# Altium project PHANTOM_VCU.PrjPcb (part 1 of 4)
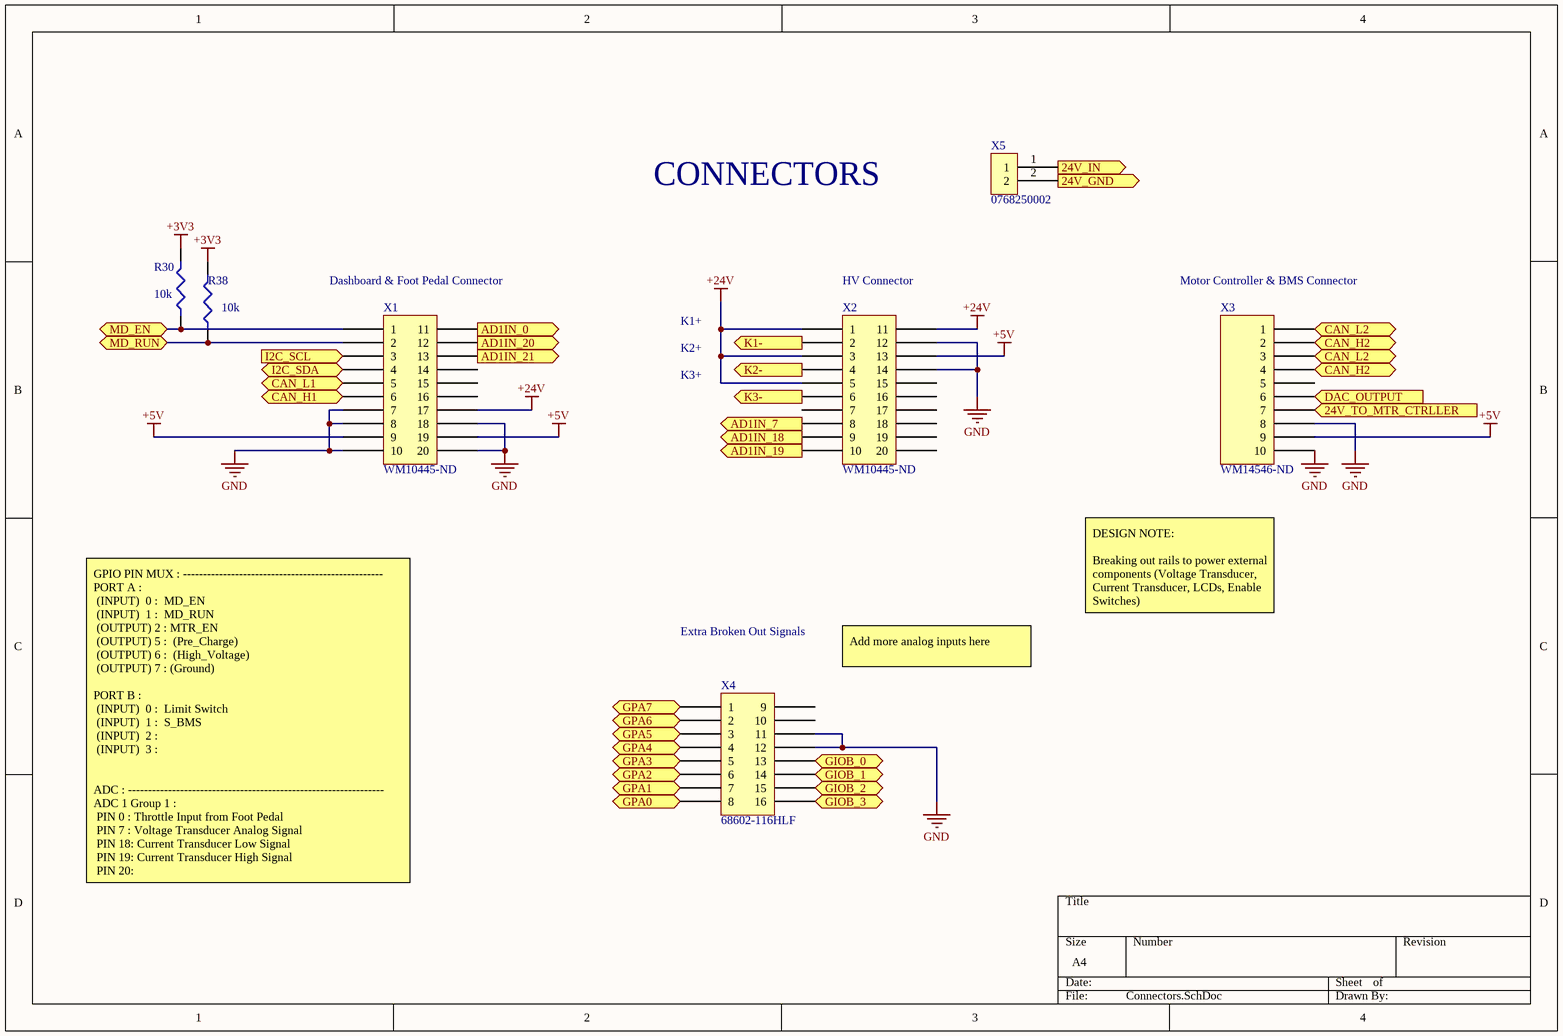
[diagram p0: Connectors.SchDoc]
8 sheets, 173 parts. Net scope: flat (ports and power ports of the same name join across sheets).
Board file: VCU_LAYOUT.PcbDoc
Sheets:
  Connectors.SchDoc
  Power_Sensing.SchDoc
  Power_MCU.SchDoc
  VCU_Schematic.SchDoc
  MCU_Signals.SchDoc
  CAN.SchDoc
  Contactor_Switching.SchDoc
  ADC_Decoupling.SchDoc

## Sheet Connectors.SchDoc
size A4; DocumentNumber: 1; SheetNumber: 1; SheetTotal: 8

### Parts
R30  10k  [R0805]
R38  10k  [R0805]
X1  WM10445-ND  [MOLEX_20pin]
X2  WM10445-ND  [MOLEX_20pin]
X3  WM14546-ND  [MOLEX_10PIN]
X4  68602-116HLF  [16PIN_HEADER]
X5  0768250002  [MOLEX_2PIN_MEGAFIT]

### Ports
24V_GND, 24V_IN, 24V_TO_MTR_CTRLLER, AD1IN_0, AD1IN_7, AD1IN_18, AD1IN_19, AD1IN_20, AD1IN_21, CAN_H1, CAN_H2, CAN_L1, CAN_L2, DAC_OUTPUT, GIOB_0, GIOB_1, GIOB_2, GIOB_3, GPA0, GPA1, GPA2, GPA3, GPA4, GPA5, GPA6, GPA7, I2C_SCL, I2C_SDA, K1-, K2-, K3-, MD_EN, MD_RUN

### Nets
+3V3: R30.2 R38.2
+5V: X1.9 X1.19 X2.13 X3.9
+24V: X1.17 X2.1 X2.3 X2.5 X2.11
GND: X1.7 X1.8 X1.10 X1.18 X1.20 X2.12 X2.14 X3.8 X3.10 X4.11 X4.12
24V_GND: X5.2 ; port 24V_GND
24V_IN: X5.1 ; port 24V_IN
24V_MC: X3.7 ; port 24V_TO_MTR_CTRLLER
AD1IN_0: X1.11 ; port AD1IN_0
AD1IN_7: X2.8 ; port AD1IN_7
AD1IN_18: X2.9 ; port AD1IN_18
AD1IN_19: X2.10 ; port AD1IN_19
AD1IN_20: X1.12 ; port AD1IN_20
AD1IN_21: X1.13 ; port AD1IN_21
CAN_H1: X1.6 ; port CAN_H1
CAN_H2: X3.2 X3.4 ; port CAN_H2
CAN_L1: X1.5 ; port CAN_L1
CAN_L2: X3.1 X3.3 ; port CAN_L2
DAC_OUTPUT: X3.6 ; port DAC_OUTPUT
GIOB_0: X4.13 ; port GIOB_0
GIOB_1: X4.14 ; port GIOB_1
GIOB_2: X4.15 ; port GIOB_2
GIOB_3: X4.16 ; port GIOB_3
GPA0: X4.8 ; port GPA0
GPA1: X4.7 ; port GPA1
GPA2: X4.6 ; port GPA2
GPA3: X4.5 ; port GPA3
GPA4: X4.4 ; port GPA4
GPA5: X4.3 ; port GPA5
GPA6: X4.2 ; port GPA6
GPA7: X4.1 ; port GPA7
I2C_SCL: X1.3 ; port I2C_SCL
I2C_SDA: X1.4 ; port I2C_SDA
K1-: X2.2 ; port K1-
K2-: X2.4 ; port K2-
K3-: X2.6 ; port K3-
MD_EN: R30.1 X1.1 ; port MD_EN
MD_RUN: R38.1 X1.2 ; port MD_RUN

Not connected (* = marked no-connect by the designer): X1 14 15 16; X2 7 15 16 17 18 19 20; X3 5; X4 9 10

### Notes on the sheet
- CONNECTORS
- (near X1) Dashboard & Foot Pedal Connector
- (near X2) HV Connector
- (near X3) Motor Controller & BMS Connector
- K1+
- K2+
- K3+
- Extra Broken Out Signals
- DESIGN NOTE:
  Breaking out rails to power external components (Voltage Transducer, Current Transducer, LCDs, Enable Switches)
- Add more analog inputs here
- GPIO PIN MUX : --------------------------------------------------
  PORT A :
  (INPUT)		0 : 	MD_EN
  (INPUT)		1 : 	MD_RUN
  (OUTPUT)	2 :	MTR_EN
  (OUTPUT)	5 : 	(Pre_Charge)
  (OUTPUT)	6 : 	(High_Voltage)
  (OUTPUT)	7 :	(Ground)
  PORT B :
  (INPUT)		0 : 	Limit Switch
  (INPUT)		1 : 	S_BMS
  (INPUT)		2 :
  (INPUT)		3 :
  ADC : ----------------------------------------------------------------
  ADC 1 Group 1 :
  PIN 0 : Throttle Input from Foot Pedal
  PIN 7 : Voltage Transducer Analog Signal
  PIN 18: Current Transducer Low Signal
  PIN 19: Current Transducer High Signal
  PIN 20:

### Library data of the parts
R30 R38 = RC0805FR-071KL: RES SMD 10K OHM 1% 1/8W 0805; Manufacturer: Yageo Phycomp; Temperature Coefficient: 100ppm/°C; Resistance: 1KR; Voltage Rating (DC): 150V; Power Rating: 125mW; Supplier 1: Digi-Key; Manufacturer Part Number: RC0805FR-071KL; Stock 1: 5527973; Pricing 1: 1=0.1, 10=0.022, 100=0.0088, 1000=0.004, 2500=0.0034 (USD); Case/Package: 0805; Number of Pins: 2; Min Operating Temperature: -55°C; Max Operating Temperature: 155°C; Tolerance: 1%; Packaging: Cut Tape; Length: 2mm; Height: 0.5mm; Width: 1.25mm; Depth: 1.25mm; REACH SVHC: No SVHC; Lead Free: Lead Free
X1 X2 = 0346916200: CONN_20Positions Molex Stac64 Header, Shrouded Connector 0.100" (2.54mm) Through Hole, Right Angle Tin; Number of Positions: 20; Connector Type: Male Pin; Pitch: 0.1inch; Supplier 1: Digi-Key; Manufacturer: Molex; Manufacturer Part Number: 0346916200; Stock 1: 334; Pricing 1: 1=3.07, 10=2.946, 100=2.4546, 500=2.0864, 1000=1.7796, 5000=1.5955 (USD); Case/Package: 100; Colour: Black; Contact Plating: Tin; Package Quantity: 560; Packaging: Tray; Number of Rows: 2; Termination: Solder; Row Spacing: 0.1inch; ComponentLink1URL: https://datasheet.ciiva.com/29142/987651-0141-29142848.pdf; ComponentLink1Description: https://datasheet.ciiva.com/29142/987651-0141-29142848.pdf; Supplier Part Number 1: WM10445-ND
X3 = 0346960101: CONN_10Positions Molex Stac64 Thru-Hole Tray; Number of Positions: 10; Gender: Male; Connector Type: Male Pin; Row Spacing: 0.248inch; Pitch: 2.54mm; Supplier 1: Digi-Key; Manufacturer: Molex; Manufacturer Part Number: 0346960101; Stock 1: 1144; Pricing 1: 1=2.65, 10=2.54, 100=2.1164, 500=1.7989, 1000=1.5344, 5000=1.3757 (USD); Mount: Through Hole; Colour: Grey; Contact Plating: Tin; Contact Material: Copper; Housing Colour: Natural; Housing Material: Thermoplastic; Min Operating Temperature: -40°C; Max Operating Temperature: 100°C; Package Quantity: 560; Number of Rows: 2; Fastening Type: Latch; Packaging: Tray; Termination: Solder; Number of Contacts: 10; Orientation: Right Angle; Length: 34.04mm; ComponentLink1URL: https://datasheet.ciiva.com/6844/346960101-sd-6844161.pdf; ComponentLink1Description: https://datasheet.ciiva.com/6844/346960101-sd-6844161.pdf; ComponentLink2URL: https://datasheet.ciiva.com/10081/0346960101-pcb-headers-10081642.pdf; ComponentLink2Description: https://datasheet.ciiva.com/10081/0346960101-pcb-headers-10081642.pdf; Supplier Part Number 1: WM14546-ND
X4 = 68602-116HLF: CONN_HeaderPins16pos1  6 Positions Header, Unshrouded Connector 0.100" (2.54mm) Through Hole Gold or Gold, GXT™; Manufacturer: Amphenol FCI; Current Rating: 3A; Voltage Rating: 1.5kV; Number of Positions: 16; Gender: Male; Connector Type: Male Pin; Insulation Resistance: 5GR; Row Spacing: 0.1inch; Mating Post Length: 5.84mm; Supplier 1: Digi-Key; Manufacturer Part Number: 68602-116HLF; Stock 1: 1898; Pricing 1: 1=0.79, 10=0.698, 100=0.6019, 500=0.4925, 1000=0.4378, 5000=0.383, 10000=0.3639 (USD); Mount: Through Hole; Contact Plating: Nickel,Gold,GXT; Contact Material: Bronze; Colour: Black; Housing Colour: Black; Housing Material: Thermoplastic; Min Operating Temperature: -65°C; Max Operating Temperature: 125°C; Number of Rows: 2; Packaging: Bulk; Package Quantity: 100; Termination: Solder; Max Voltage Rating (AC): 1.5kV; Number of Contacts: 16; Orientation: Straight; Contact Gender: Male; Length: 20.32mm; Pitch: 2.54mm; Depth: 4.83mm; Contact Mating Length: 0.23inch; Termination Post Length: 3.81mm; Radiation Hardening: No; REACH SVHC: No SVHC; Flammability Rating: UL94 V-0; ComponentLink1URL: https://datasheet.ciiva.com/16726/67996-16726040.pdf; ComponentLink1Description: https://datasheet.ciiva.com/16726/67996-16726040.pdf; ComponentLink2URL: https://datasheet.ciiva.com/9465/67996-9465931.pdf; ComponentLink2Description: https://datasheet.ciiva.com/9465/67996-9465931.pdf; ComponentLink3URL: https://datasheet.ciiva.com/728/67996-728940.pdf; ComponentLink3Description: https://datasheet.ciiva.com/728/67996-728940.pdf; ComponentLink4URL: https://datasheet.ciiva.com/5157/67996-225486-5157197.pdf; ComponentLink4Description: https://datasheet.ciiva.com/5157/67996-225486-5157197.pdf; Supplier Part Number 1: 609-3364-ND
X5 = 0768250002: CONN_2Position_MEGAFIT Molex Through Hole, Right Angle Tin; Number of Positions: 2; Connector Type: Male Pin; Row Spacing: 0.224inch; Supplier 1: Digi-Key; Manufacturer: Molex; Manufacturer Part Number: 0768250002; Stock 1: 2862; Pricing 1: 1=1.08, 10=0.946, 25=0.89, 50=0.853, 100=0.816, 250=0.7418, 500=0.6676, 1000=0.5934, 2500=0.5378 (USD); Mount: Through Hole; Colour: Black; Contact Plating: Tin; Packaging: Tray; Number of Rows: 2; Termination: Solder; Fastening Type: Ramp; ComponentLink1URL: http://www.molex.com/pdm_docs/ps/PS-76823-100.pdf; ComponentLink1Description: http://www.molex.com/pdm_docs/ps/PS-76823-100.pdf; Supplier Part Number 1: WM11969-ND

## Sheet Power_Sensing.SchDoc
size A4; DocumentNumber: 2; SheetNumber: 2; SheetTotal: 8
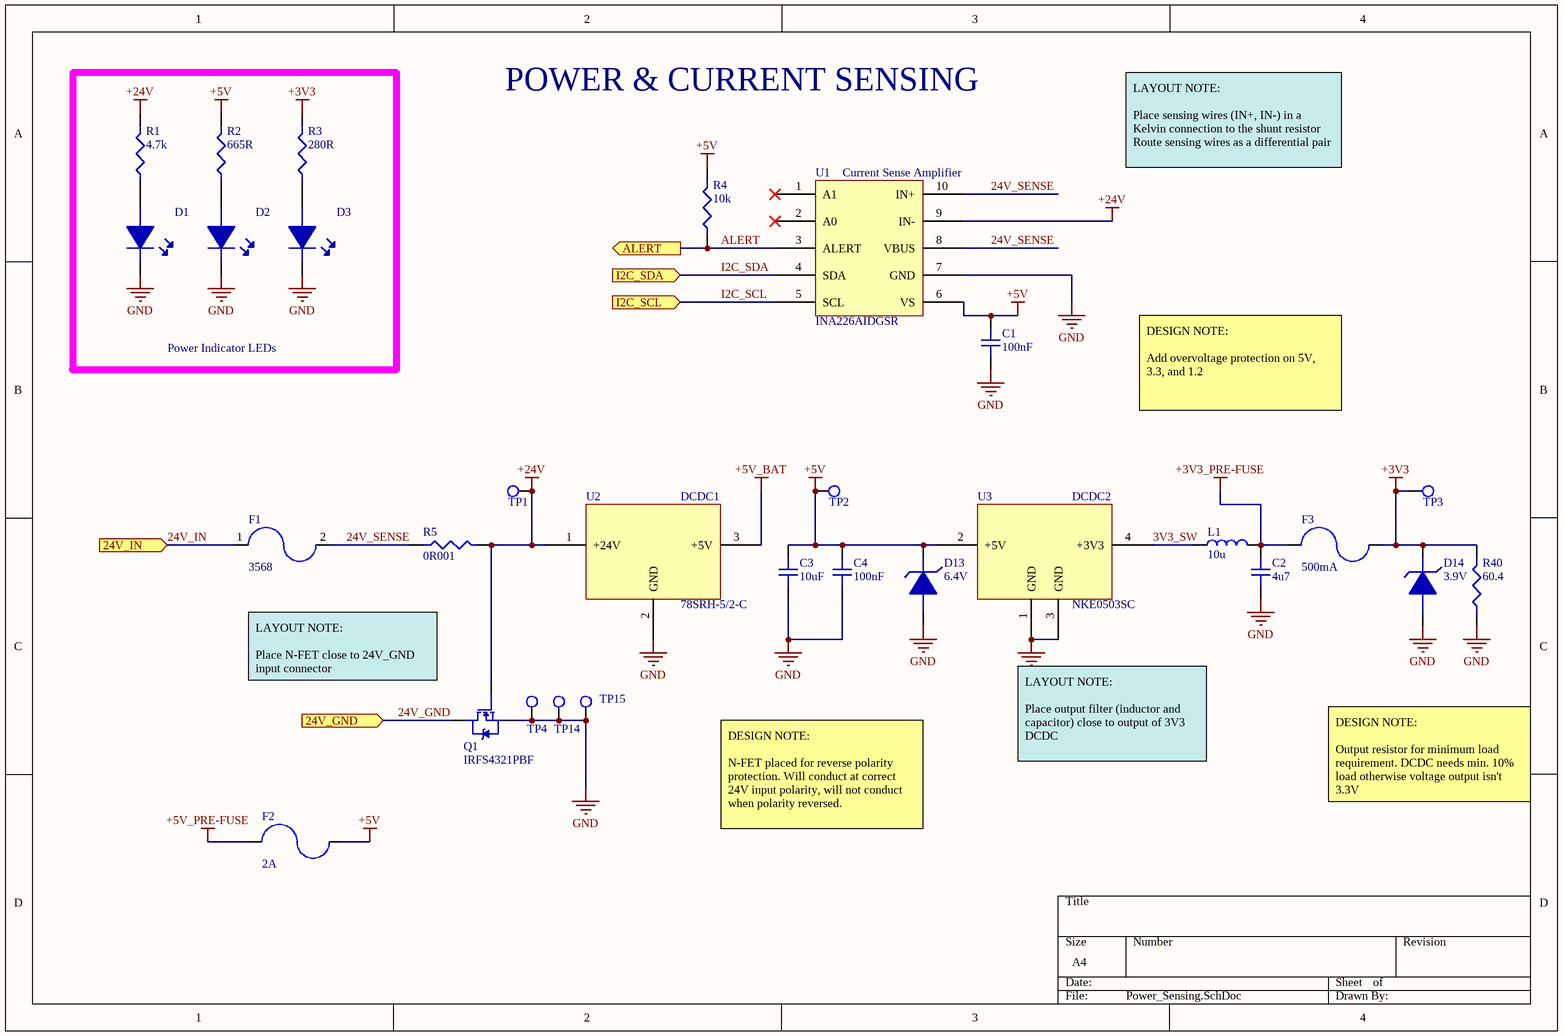
[diagram p1: Power_Sensing.SchDoc]

### Parts
C1  100nF  [C0805]
C2  4u7  [C0805]
C3  10uF  [TANT_10u]
C4  100nF  [C0805]
D1  LTST-C191KGKT  [LED_0603]  (value not drawn)
D2  LTST-C191KGKT  [LED_0603]  (value not drawn)
D3  LTST-C191KGKT  [LED_0603]  (value not drawn)
D13  6.4V  [DIODE_TVS]
D14  3.9V  [DIODE_TVS]
F1  3568  [FUSE_MINI_HOLDER]
F2  2A  [FUSE_0603]
F3  500mA  [FUSE_0603]
L1  10u  [INDUCTOR]
Q1  IRFS4321PBF  [D2PAK_FETs]
R1  4.7k  [R0805]
R2  665R  [R0805]
R3  280R  [R0805]
R4  10k  [R0805]
R5  0R001  [R2512]
R40  60.4  [R0805]
TP1  5015  [TP_HOOK]  (value not drawn)
TP2  5015  [TP_HOOK]  (value not drawn)
TP3  5015  [TP_HOOK]  (value not drawn)
TP4  5015  [TP_HOOK]  (value not drawn)
TP14  5015  [TP_HOOK]  (value not drawn)
TP15  5015  [TP_HOOK]  (value not drawn)
U1  INA226AIDGSR  [10-VSSOP_INA226]
U2  78SRH-5/2-C  [DCDC1]
U3  NKE0503SC  [DCDC2]

### Blocks framed on the sheet
Power Indicator LEDs: D1-D3 R1-R3

### Ports
24V_GND, 24V_IN, ALERT, I2C_SCL, I2C_SDA

### Nets
+3V3: D14.1 F3.2 R3.2 R40.2 TP3.1
+3V3_PRE-FUSE: C2.2 F3.1 L1.2
+5V: C1.2 C3.1 C4.2 D13.1 F2.2 R2.2 R4.2 TP2.1 U1.6(VS) U3.2(+5V)
+5V_BAT: U2.3(+5V)
+5V_PRE-FUSE: F2.1
+24V: Q1.1 R1.2 R5.2 TP1.1 U1.9(IN-) U2.1(+24V)
GND: C1.1 C2.1 C3.2 C4.1 D1.2 D2.2 D3.2 D13.2 D14.2 Q1.3 R40.1 TP4.1 TP14.1 TP15.1 U1.7(GND) U2.2(GND) U3.1(GND) U3.3(GND)
3V3_SW: L1.1 U3.4(+3V3)
24V_GND: Q1.4 ; port 24V_GND
24V_IN: F1.1 ; port 24V_IN
24V_SENSE: F1.2 R5.1 U1.8(VBUS) U1.10(IN+)
ALERT: R4.1 U1.3(ALERT) ; port ALERT
I2C_SCL: U1.5(SCL) ; port I2C_SCL
I2C_SDA: U1.4(SDA) ; port I2C_SDA
NetD1_1: D1.1 R1.1
NetD2_1: D2.1 R2.1
NetD3_1: D3.1 R3.1

Not connected (* = marked no-connect by the designer): U1 1(A1)* 2(A0)*

### Notes on the sheet
- POWER & CURRENT SENSING
- (near U1) Current Sense Amplifier
- LAYOUT NOTE:
  Place sensing wires (IN+, IN-) in a Kelvin connection to the shunt resistor
  Route sensing wires as a differential pair
- DESIGN NOTE:
  Add overvoltage protection on 5V, 3.3, and 1.2
- (near U2) DCDC1
- (near U3) DCDC2
- (near Q1) LAYOUT NOTE:
  Place N-FET close to 24V_GND input connector
- LAYOUT NOTE:
  Place output filter (inductor and capacitor) close to output of 3V3 DCDC
- DESIGN NOTE:
  N-FET placed for reverse polarity protection. Will conduct at correct 24V input polarity, will not conduct when polarity reversed.
- DESIGN NOTE:
  Output resistor for minimum load requirement. DCDC needs min. 10% load otherwise voltage output isn't 3.3V

### Library data of the parts
C1 C4 = GRM21B7U1A104JA01L: CAP MLCC 100nF 10Volts U2J 5%; Manufacturer: Murata; Voltage Rating: 10V; Supplier 1: Digi-Key; Manufacturer Part Number: GRM21B7U1A104JA01L; Stock 1: 6000; Pricing 1: 1=0.46, 10=0.32, 100=0.192, 500=0.144, 1000=0.1216 (USD); Mount: Surface Mount; Case/Package: 0805; Case Code (Imperial): 0805; Case Code (Metric): 2012; Min Operating Temperature: -55°C; Max Operating Temperature: 125°C; Capacitance: 100nF; Voltage Rating (DC): 10V; Tolerance: 5%; Packaging: Tape and Reel; Package Quantity: 3000; Dielectric: U2J; Termination: SMD/SMT; Length: 2mm; Height: 1.25mm; Width: 0.049inch; Thickness: 0.053inch; Depth: 1.25mm; Radiation Hardening: No; ComponentLink1URL: https://datasheet.ciiva.com/5424/product-5424660.pdf; ComponentLink1Description: https://datasheet.ciiva.com/5424/product-5424660.pdf; ComponentLink2URL: https://datasheet.ciiva.com/17451/product-17451845.pdf; ComponentLink2Description: https://datasheet.ciiva.com/17451/product-17451845.pdf; ComponentLink3URL: https://datasheet.ciiva.com/11618/product-11618924.pdf; ComponentLink3Description: https://datasheet.ciiva.com/11618/product-11618924.pdf; Supplier Part Number 1: 490-11592-6-ND
C2 = GRM219R61A475KE34D: CAP MLCC 4.7µF ±10% 10V X5R Ceramic Capacitor -55°C ~ 85°C Surface Mount, MLCC 0805 (2012 Metric) 0.079" L x 0.049" W (2.00mm x 1.25mm); Manufacturer: Murata; Capacitance: 4.7uF; Supplier 1: Digi-Key; Manufacturer Part Number: GRM219R61A475KE34D; Stock 1: 251830; Pricing 1: 1=0.21, 10=0.152, 100=0.0716, 500=0.0502, 1000=0.0416 (USD); Mount: Surface Mount; Case/Package: 0805; Case Code (Metric): 2012; Case Code (Imperial): 0805; Min Operating Temperature: -55°C; Max Operating Temperature: 85°C; Packaging: Tape and Reel; Tolerance: 10%; Package Quantity: 4000; Voltage Rating: 10V; Voltage Rating (DC): 10V; Dielectric: X5R; Termination: SMD/SMT; Voltage: 10V; Length: 2mm; Height: 0.85mm; Width: 0.049inch; Thickness: 0.037inch; Depth: 1.25mm; Lead Free: Lead Free; ComponentLink1URL: https://datasheet.ciiva.com/169/product-169527.pdf; ComponentLink1Description: https://datasheet.ciiva.com/169/product-169527.pdf; ComponentLink2URL: https://datasheet.ciiva.com/5414/product-5414984.pdf; ComponentLink2Description: https://datasheet.ciiva.com/5414/product-5414984.pdf; ComponentLink3URL: https://datasheet.ciiva.com/16467/product-16467258.pdf; ComponentLink3Description: https://datasheet.ciiva.com/16467/product-16467258.pdf; ComponentLink4URL: https://datasheet.ciiva.com/29542/product-29542667.pdf; ComponentLink4Description: https://datasheet.ciiva.com/29542/product-29542667.pdf; ComponentLink5URL: https://datasheet.ciiva.com/29542/product-29542668.pdf; ComponentLink5Description: https://datasheet.ciiva.com/29542/product-29542668.pdf; Supplier Part Number 1: 490-3339-6-ND
C3 = F381A106MMA: CAP TANTALUM 10uF, 0603 [1608 Metric], 0.5 ohm, 10 V AVX  Surface Mount Tantalum Capacitor, F38 Series, 10uF, 0603 [1608 Metric], 0.5 ohm, 10 V; Manufacturer: Kyocera AVX; Tolerance: 20%; ESR (Equivalent Series Resistance): 500mR; Voltage Rating: 10V; Life (Hours): 1000Hour; Dissipation Factor: 15%; Leakage Current: 10uA; Supplier 1: Digi-Key; Manufacturer Part Number: F381A106MMA; Stock 1: 7989; Pricing 1: 1=0.75, 10=0.551, 100=0.3779, 500=0.2992, 1000=0.2519 (USD); Case/Package: 0603; Weight: 7.1E-05oz; Case Code (Metric): 1608; Case Code (Imperial): 0603; Min Operating Temperature: -55°C; Max Operating Temperature: 105°C; Capacitance: 10uF; Packaging: Tape and Reel; Termination: SMD/SMT; Package Quantity: 4000; Voltage Rating (DC): 10V; Length: 1.6mm; Height: 0.8mm; Width: 0.033inch; Height - Seated (Max): 0.035inch; Depth: 0.85mm; Radiation Hardening: No; REACH SVHC: No SVHC; ComponentLink1URL: https://datasheet.ciiva.com/48510/f38-48510901.pdf; ComponentLink1Description: https://datasheet.ciiva.com/48510/f38-48510901.pdf; ComponentLink2URL: https://datasheet.ciiva.com/46417/1805432-46417517.pdf; ComponentLink2Description: https://datasheet.ciiva.com/46417/1805432-46417517.pdf; ComponentLink3URL: https://datasheet.ciiva.com/46417/1805432-46417518.pdf; ComponentLink3Description: https://datasheet.ciiva.com/46417/1805432-46417518.pdf; Supplier Part Number 1: 478-9527-1-ND
D1-D3 = LTST-C191KGKT: LED GREEN CLEAR 0603 SMD; Manufacturer: Vishay Lite-On; Lens Colour: Clear,Colorless; Power Rating: 75mW; Luminous Intensity: 35mcd; Viewing Angle: 130°; Lens Style: Clear,Diffused,Colorless,Rectangular; Forward Current: 30mA; Forward Voltage: 2V; Dominant Wavelength: 571nm; Test Current: 20mA; Number of Elements: 1; Wavelength: 574nm; Supplier 1: Digi-Key; Manufacturer Part Number: LTST-C191KGKT; Stock 1: 1301664; Pricing 1: 1=0.29, 10=0.211, 25=0.1556, 100=0.1111, 250=0.0756, 500=0.0667, 1000=0.0522, 2500=0.0511 (USD); Mount: Surface Mount; Case/Package: 0603; Number of Pins: 2; Colour: Green; Case Code (Metric): 1608; Case Code (Imperial): 0603; Min Operating Temperature: -55°C; Max Operating Temperature: 85°C; Packaging: Tape and Reel; Package Quantity: 1; Illumination Colour: Green; Lens Transparency: Clear; Power Dissipation: 75mW; Number of LEDs: 1; Length: 1.6mm; Height: 0.55mm; Width: 0.8mm; Depth: 0.8mm; Radiation Hardening: No; Lead Free: Lead Free; ComponentLink1URL: https://datasheet.ciiva.com/12400/100-ltst-c191kgkt-53586-12400818.pdf; ComponentLink1Description: https://datasheet.ciiva.com/12400/100-ltst-c191kgkt-53586-12400818.pdf; ComponentLink2URL: https://datasheet.ciiva.com/2109/s-110-ltst-c191kgkt-2109973.pdf; ComponentLink2Description: https://datasheet.ciiva.com/2109/s-110-ltst-c191kgkt-2109973.pdf; ComponentLink3URL: https://datasheet.ciiva.com/2109/s-110-ltst-c191kgkt-2109974.pdf; ComponentLink3Description: https://datasheet.ciiva.com/2109/s-110-ltst-c191kgkt-2109974.pdf; ComponentLink4URL: https://datasheet.ciiva.com/2109/s-110-ltst-c191kgkt-2109975.pdf; ComponentLink4Description: https://datasheet.ciiva.com/2109/s-110-ltst-c191kgkt-2109975.pdf; ComponentLink5URL: https://datasheet.ciiva.com/15223/getdatasheetpartid-103913-15223276.pdf; ComponentLink5Description: https://datasheet.ciiva.com/15223/getdatasheetpartid-103913-15223276.pdf; ComponentLink6URL: https://datasheet.ciiva.com/11773/0900766b80dc02b1-11773629.pdf; ComponentLink6Description: https://datasheet.ciiva.com/11773/0900766b80dc02b1-11773629.pdf; ComponentLink7URL: https://datasheet.ciiva.com/16215/ltst-c191kgkt-16215151.pdf; ComponentLink7Description: https://datasheet.ciiva.com/16215/ltst-c191kgkt-16215151.pdf; Supplier Part Number 1: 160-1446-6-ND
D13 = SMAJ5.0A: DIODE TVS_6V4 5VWM 9.2VC SMA; Manufacturer: Littelfuse; Clamping Voltage: 9.2V; Polarity: Unidirectional; Power Dissipation: 400W; Voltage Rating (DC): 5V; Number of Elements: 1; Max Surge Current: 43.5A; Power Line Protection: No; Test Current: 10mA; Max Breakdown Voltage: 7V; Max Reverse Leakage Current: 800uA; Max Power Dissipation: 3.3W; Element Configuration: Single; Supplier 1: Digi-Key; Manufacturer Part Number: SMAJ5.0A; Stock 1: 78251; Pricing 1: 1=0.51, 10=0.359, 25=0.2948, 100=0.2359, 250=0.1716, 500=0.1394, 1000=0.1072, 2500=0.0965 (USD); Mount: Surface Mount; Number of Pins: 2; Min Operating Temperature: -65°C; Max Operating Temperature: 150°C; Direction: Unidirectional; Package Quantity: 5000; Operating Supply Voltage: 5V; Packaging: Tape and Reel; Reverse Breakdown Voltage: 6.4V; Number of Unidirectional Channels: 1; Reverse Standoff Voltage: 5V; Min Breakdown Voltage: 6.4V; Peak Pulse Power: 400W; Breakdown Voltage: 6.4V; Number of Channels: 1; Termination: SMD/SMT; Peak Pulse Current: 43.5A; Leakage Current: 800uA; Length: 4.5mm; Height: 2.087mm; Width: 2.79mm; Radiation Hardening: No; REACH SVHC: No SVHC; Lead Free: Lead Free; ComponentLink1URL: https://datasheet.ciiva.com/330/littelfuse-tvs-diode-smaj-datasheet-pdf-330724.pdf; ComponentLink1Description: https://datasheet.ciiva.com/330/littelfuse-tvs-diode-smaj-datasheet-pdf-330724.pdf; ComponentLink2URL: https://datasheet.ciiva.com/330/littelfuse-tvs-diode-smaj-datasheet-pdf-330725.pdf; ComponentLink2Description: https://datasheet.ciiva.com/330/littelfuse-tvs-diode-smaj-datasheet-pdf-330725.pdf; ComponentLink3URL: https://datasheet.ciiva.com/330/littelfuse-tvs-diode-smaj-datasheet-pdf-330726.pdf; ComponentLink3Description: https://datasheet.ciiva.com/330/littelfuse-tvs-diode-smaj-datasheet-pdf-330726.pdf; ComponentLink4URL: https://datasheet.ciiva.com/16380/littelfuse-tvs-diode-smaj-16380982.pdf; ComponentLink4Description: https://datasheet.ciiva.com/16380/littelfuse-tvs-diode-smaj-16380982.pdf; ComponentLink5URL: https://datasheet.ciiva.com/25624/0900766b810f4edb-25624839.pdf; ComponentLink5Description: https://datasheet.ciiva.com/25624/0900766b810f4edb-25624839.pdf; ComponentLink6URL: https://datasheet.ciiva.com/28473/607617-28473433.pdf; ComponentLink6Description: https://datasheet.ciiva.com/28473/607617-28473433.pdf; ComponentLink7URL: https://datasheet.ciiva.com/4507/littelfuse-tvs-diode-smaj-23503-4507964.pdf; ComponentLink7Description: https://datasheet.ciiva.com/4507/littelfuse-tvs-diode-smaj-23503-4507964.pdf; ComponentLink8URL: https://datasheet.ciiva.com/8062/littelfuse-tvs-diode-smaj-8062271.pdf; ComponentLink8Description: https://datasheet.ciiva.com/8062/littelfuse-tvs-diode-smaj-8062271.pdf; Supplier Part Number 1: SMAJ5.0ALFCT-ND
D14 = 1SMA5915BT3G: DIODE ZENER 3.9V 1.5W SMA; Manufacturer: ON Semiconductor; Tolerance: 5%; Max Reverse Leakage Current: 12.5uA; Impedance: 7.5R; Element Configuration: Single; Forward Voltage: 1.5V; Power Dissipation: 500mW; Zener Current: 385mA; Test Current: 96.1mA; Breakdown Voltage: 12V; ESD Protection: Yes; Supplier 1: Digi-Key; Manufacturer Part Number: 1SMA5915BT3G; Stock 1: 21605; Pricing 1: 1=0.41, 10=0.335, 100=0.2284, 500=0.1713, 1000=0.1285 (USD); Case/Package: SMA; Number of Pins: 2; Contact Plating: Tin,Matte; Min Operating Temperature: -65°C; Max Operating Temperature: 150°C; Max Power Dissipation: 1.5W; Package Quantity: 1; Packaging: Tape and Reel; Zener Voltage: 3.9V; Voltage Tolerance: 5%; Working Voltage: 3.9V; Peak Reverse Current: 12.5uA; Power Rating: 1.5W; Voltage Rating (DC): 3.9V; Length: 4.57mm; Height: 2.05mm; Width: 2.92mm; Radiation Hardening: No; Lead Free: Lead Free; Halogen Free: Halogen Free; REACH SVHC: No SVHC; ComponentLink1URL: https://datasheet.ciiva.com/895/1sma5913bt3-d-895333.pdf; ComponentLink1Description: https://datasheet.ciiva.com/895/1sma5913bt3-d-895333.pdf; ComponentLink2URL: https://datasheet.ciiva.com/26092/1sma5913bt3-d-26092405.pdf; ComponentLink2Description: https://datasheet.ciiva.com/26092/1sma5913bt3-d-26092405.pdf; ComponentLink3URL: https://datasheet.ciiva.com/895/1sma5913bt3-d-895334.pdf; ComponentLink3Description: https://datasheet.ciiva.com/895/1sma5913bt3-d-895334.pdf; ComponentLink4URL: https://datasheet.ciiva.com/895/1sma5913bt3-d-895335.pdf; ComponentLink4Description: https://datasheet.ciiva.com/895/1sma5913bt3-d-895335.pdf; ComponentLink5URL: https://datasheet.ciiva.com/8026/1sma5913bt3-d-8026919.pdf; ComponentLink5Description: https://datasheet.ciiva.com/8026/1sma5913bt3-d-8026919.pdf; ComponentLink6URL: https://datasheet.ciiva.com/16311/1sma5913bt3-d-16311880.pdf; ComponentLink6Description: https://datasheet.ciiva.com/16311/1sma5913bt3-d-16311880.pdf; ComponentLink7URL: https://datasheet.ciiva.com/10639/1sma5913bt3-d-10639017.pdf; ComponentLink7Description: https://datasheet.ciiva.com/10639/1sma5913bt3-d-10639017.pdf; Supplier Part Number 1: 1SMA5915BT3GOSCT-ND
F1 = 3568: FUSE HOLDER MINI AUTO PC; Manufacturer: Keystone Electronics; Colour: Black; Material: Brass,Nickel,Tin,Nylon; Body Material: Nylon; Current Rating: 20A; Voltage Rating (AC): 500V; Number of Poles: 1; Illumination Type: Illuminated; Fuse Type: Automotive; Approvals: UL; Supplier 1: Digi-Key; Manufacturer Part Number: 3568; Stock 1: 69840; Pricing 1: 1=0.98, 10=0.853, 50=0.7694, 100=0.7359, 250=0.669, 1000=0.599, 2500=0.502, 5000=0.4683 (USD); Mount: Vertical,PCB; Contact Material: Brass,Nickel,Tin; Contact Plating: Tin; Min Operating Temperature: -50°C; Max Operating Temperature: 145°C; Package Quantity: 1; Number of Circuits: 1; Voltage: 500V; Termination: PC Pin; Fuse Current: 20A; Orientation: Vertical; Length: 16mm; Depth: 6.73mm; REACH SVHC: No SVHC; Lead Free: Lead Free; Flammability Rating: UL94 V-0; ComponentLink1URL: https://datasheet.ciiva.com/16294/m60-2p40-16294706.pdf; ComponentLink1Description: https://datasheet.ciiva.com/16294/m60-2p40-16294706.pdf; ComponentLink2URL: https://datasheet.ciiva.com/16874/70182101-16874378.pdf; ComponentLink2Description: https://datasheet.ciiva.com/16874/70182101-16874378.pdf; Supplier Part Number 1: 36-3568-ND
F2 = 0603SFV200F/32-2: FUSE_2A SMD 0603 LITTELFUSE; Supplier 1: Digi-Key; Manufacturer: Littelfuse; Manufacturer Part Number: 0603SFV200F/32-2; Stock 1: 17588; Pricing 1: 1=1.2, 5=1.166, 10=1.091, 50=0.9028, 100=0.7524, 250=0.7336, 500=0.6207, 1000=0.5455 (USD); ComponentLink1URL: //media.digikey.com/pdf/Data%20Sheets/Littelfuse%20PDFs/SMD_Fuses_Fundamentals.pdf; ComponentLink1Description: //media.digikey.com/pdf/Data%20Sheets/Littelfuse%20PDFs/SMD_Fuses_Fundamentals.pdf; Supplier Part Number 1: 0603SFV200F/32-2CT-ND; Current Rating: 2A
F3 = ERB-RE0R50V: FUSE_0.5A SMD 0603, 0.5A; Manufacturer: Panasonic ECG; Body Material: Alumina; Voltage Rating (DC): 32V; DC Cold Resistance: 330mR; Fuse Type: Board Mount (Cartridge Style Excluded); Approvals: UL; Supplier 1: Digi-Key; Manufacturer Part Number: ERB-RE0R50V; Stock 1: 15715; Pricing 1: 1=0.29, 5=0.284, 10=0.272, 50=0.2424, 100=0.2257, 250=0.2006, 500=0.1672, 1000=0.1588 (USD); Mount: Surface Mount; Case/Package: 0603; Number of Pins: 2; Case Code (Metric): 1608; Case Code (Imperial): 0603; Min Operating Temperature: -40°C; Max Operating Temperature: 125°C; Current Rating: 500mA; Packaging: Tape and Reel; Package Quantity: 5000; Max Voltage Rating (DC): 32V; Voltage Rating: 32V; Current: 500mA; Fuse Current: 500mA; Length: 1.6mm; Height: 0.54mm; Width: 0.8mm; Depth: 0.8mm; Radiation Hardening: No; REACH SVHC: No SVHC; ComponentLink1URL: https://datasheet.ciiva.com/299/afa0000ce6-299092.pdf; ComponentLink1Description: https://datasheet.ciiva.com/299/afa0000ce6-299092.pdf; ComponentLink2URL: https://datasheet.ciiva.com/299/afa0000ce6-299093.pdf; ComponentLink2Description: https://datasheet.ciiva.com/299/afa0000ce6-299093.pdf; ComponentLink3URL: https://datasheet.ciiva.com/299/afa0000ce6-299094.pdf; ComponentLink3Description: https://datasheet.ciiva.com/299/afa0000ce6-299094.pdf; ComponentLink4URL: https://datasheet.ciiva.com/25619/0900766b810c2f76-25619783.pdf; ComponentLink4Description: https://datasheet.ciiva.com/25619/0900766b810c2f76-25619783.pdf; ComponentLink5URL: https://datasheet.ciiva.com/11337/afa0000ce6-11337817.pdf; ComponentLink5Description: https://datasheet.ciiva.com/11337/afa0000ce6-11337817.pdf; ComponentLink6URL: https://datasheet.ciiva.com/5813/1328695-5813626.pdf; ComponentLink6Description: https://datasheet.ciiva.com/5813/1328695-5813626.pdf; ComponentLink7URL: https://datasheet.ciiva.com/46388/1328695-46388892.pdf; ComponentLink7Description: https://datasheet.ciiva.com/46388/1328695-46388892.pdf; ComponentLink8URL: https://datasheet.ciiva.com/30017/afa0000ce6-30017405.pdf; ComponentLink8Description: https://datasheet.ciiva.com/30017/afa0000ce6-30017405.pdf; ComponentLink9URL: https://datasheet.ciiva.com/46376/1328695-46376557.pdf; ComponentLink9Description: https://datasheet.ciiva.com/46376/1328695-46376557.pdf; Supplier Part Number 1: P15127CT-ND
L1 = 82103C: Inductor Fixed 10uH 0.5A Mini SMT Power; Manufacturer: Murata; Tolerance: 10%; Self Resonant Frequency: 38MHz; Q Factor: 35; Current Rating: 500mA; Shielding: Unshielded; DC Resistance (DCR): 400mR; Test Frequency: 10KHz; Supplier 1: Digi-Key; Manufacturer Part Number: 82103C; Stock 1: 1668; Pricing 1: 1=0.32, 100=0.2906 (USD); Mount: Surface Mount; Case/Package: 1210; Case Code (Metric): 3225; Case Code (Imperial): 1210; Min Operating Temperature: -40°C; Max Operating Temperature: 85°C; Packaging: Tape and Reel; Package Quantity: 1; Composition: Wirewound; Inductance: 10uh; Max DC Current: 500mA; Termination: SMD/SMT; DC Current: 500mA; Military Standard: Not; Length: 0.126inch; Height: 2mm; Width: 0.098inch; Height - Seated (Max): 0.092inch; Depth: 2.7mm; Radiation Hardening: No; ComponentLink1URL: https://datasheet.ciiva.com/6690/kmp-8200c-6690973.pdf; ComponentLink1Description: https://datasheet.ciiva.com/6690/kmp-8200c-6690973.pdf; ComponentLink2URL: https://datasheet.ciiva.com/6690/kmp-8200c-6690974.pdf; ComponentLink2Description: https://datasheet.ciiva.com/6690/kmp-8200c-6690974.pdf; ComponentLink3URL: https://datasheet.ciiva.com/6690/kmp-8200c-6690975.pdf; ComponentLink3Description: https://datasheet.ciiva.com/6690/kmp-8200c-6690975.pdf; Supplier Part Number 1: 811-2473-6-ND
Q1 = IRFS4321PBF: MOSFET  N Channel, 83 A, 150 V, 0.012 ohm, 10 V, 5 V; Manufacturer: Infineon; Drain to Source Voltage (Vdss): 150V; Continuous Drain Current (ID): 85A; Rds On Max: 15mR; Input Capacitance: 4.46nF; Max Power Dissipation: 350W; Threshold Voltage: 5V; Supplier 1: Digi-Key; Manufacturer Part Number: IRFS4321PBF; Stock 1: 1426; Pricing 1: 1=3.12, 10=2.804, 100=2.2973, 500=1.9556, 1000=1.6493 (USD); Mount: Surface Mount; Case/Package: TO-263-3; Number of Pins: 3; Min Operating Temperature: -55°C; Max Operating Temperature: 175°C; Packaging: Rail/Tube; REACH SVHC: No SVHC; Lead Free: Lead Free; ComponentLink1URL: http://www.farnell.com/datasheets/1308989.pdf; ComponentLink1Description: http://www.farnell.com/datasheets/1308989.pdf; Supplier Part Number 1: IRFS4321PBF-ND
R1 = RC0805FR-074K7L: RES SMD 4.7K OHM 1% 1/8W 0805; Manufacturer: Yageo; Resistance: 4.7KR; Temperature Coefficient: 100ppm/°C; Power Rating: 125mW; Voltage Rating: 150V; Supplier 1: Digi-Key; Manufacturer Part Number: RC0805FR-074K7L; Stock 1: 2632902; Pricing 1: 1=0.1, 10=0.022, 100=0.0088, 1000=0.004, 2500=0.0034 (USD); Case/Package: 0805; Number of Pins: 2; Case Code (Metric): 2012; Case Code (Imperial): 0805; Min Operating Temperature: -55°C; Max Operating Temperature: 155°C; Packaging: Tape and Reel; Tolerance: 1%; Composition: Thick Film; Voltage Rating (DC): 150V; Termination: SMD/SMT; Military Standard: Not; Package Quantity: 5000; Number of Terminations: 2; Max Power Dissipation: 125mW; Length: 0.079inch; Height: 0.024inch; Width: 0.049inch; Depth: 1.25mm; REACH SVHC: No SVHC; Lead Free: Lead Free; ComponentLink1URL: https://datasheet.ciiva.com/11808/0900766b8106beab-11808155.pdf; ComponentLink1Description: https://datasheet.ciiva.com/11808/0900766b8106beab-11808155.pdf; ComponentLink2URL: https://datasheet.ciiva.com/7941/444164-7941804.pdf; ComponentLink2Description: https://datasheet.ciiva.com/7941/444164-7941804.pdf; ComponentLink3URL: https://datasheet.ciiva.com/7941/1686128-7941805.pdf; ComponentLink3Description: https://datasheet.ciiva.com/7941/1686128-7941805.pdf; ComponentLink4URL: https://datasheet.ciiva.com/7941/444164-7941806.pdf; ComponentLink4Description: https://datasheet.ciiva.com/7941/444164-7941806.pdf; ComponentLink5URL: https://datasheet.ciiva.com/6547/pyu-r-int-thick-7-6547263.pdf; ComponentLink5Description: https://datasheet.ciiva.com/6547/pyu-r-int-thick-7-6547263.pdf; ComponentLink6URL: https://datasheet.ciiva.com/46447/444164-46447583.pdf; ComponentLink6Description: https://datasheet.ciiva.com/46447/444164-46447583.pdf; Supplier Part Number 1: 311-4.70KCRDKR-ND
R2 = RC0805FR-07665RL: RES SMD 665 OHM 1% 1/8W 0805; Manufacturer: Yageo; Power Rating: 125mW; Temperature Coefficient: 100ppm/°C; Voltage Rating (DC): 150V; Supplier 1: Digi-Key; Manufacturer Part Number: RC0805FR-07665RL; Stock 1: 51898; Pricing 1: 1=0.1, 10=0.022, 100=0.0088, 1000=0.004, 2500=0.0034 (USD); Case/Package: 0805; Case Code (Imperial): 0805; Case Code (Metric): 2012; Min Operating Temperature: -55°C; Max Operating Temperature: 155°C; Resistance: 665R; Tolerance: 1%; Packaging: Tape and Reel; Composition: Thick Film; Package Quantity: 1; Voltage Rating: 150V; Termination: SMD/SMT; Number of Terminations: 2; Military Standard: Not; Max Power Dissipation: 125mW; Length: 2mm; Height: 0.024inch; Width: 1.25mm; Depth: 1.25mm; Lead Free: Lead Free; ComponentLink1URL: https://datasheet.ciiva.com/17423/rc0805-17423095.pdf; ComponentLink1Description: https://datasheet.ciiva.com/17423/rc0805-17423095.pdf; ComponentLink2URL: https://datasheet.ciiva.com/12561/rc0805-257173-12561528.pdf; ComponentLink2Description: https://datasheet.ciiva.com/12561/rc0805-257173-12561528.pdf; ComponentLink3URL: https://datasheet.ciiva.com/2457/pyu-r-int-thick-7-2457788.pdf; ComponentLink3Description: https://datasheet.ciiva.com/2457/pyu-r-int-thick-7-2457788.pdf; ComponentLink4URL: https://datasheet.ciiva.com/2457/pyu-r-int-thick-7-2457789.pdf; ComponentLink4Description: https://datasheet.ciiva.com/2457/pyu-r-int-thick-7-2457789.pdf; ComponentLink5URL: https://datasheet.ciiva.com/2457/pyu-r-int-thick-7-2457790.pdf; ComponentLink5Description: https://datasheet.ciiva.com/2457/pyu-r-int-thick-7-2457790.pdf; Supplier Part Number 1: 311-665CRDKR-ND
R3 = RC0805FR-07280RL: RES SMD 280 OHM 1% 1/8W 0805; Manufacturer: Yageo; Temperature Coefficient: 100ppm/°C; Max Power Dissipation: 125mW; Voltage Rating (DC): 150V; Supplier 1: Digi-Key; Manufacturer Part Number: RC0805FR-07280RL; Stock 1: 117224; Pricing 1: 1=0.1, 10=0.022, 100=0.0088, 1000=0.004, 2500=0.0034 (USD); Case/Package: 0805; Case Code (Imperial): 0805; Case Code (Metric): 2012; Min Operating Temperature: -55°C; Max Operating Temperature: 155°C; Package Quantity: 1; Resistance: 280R; Tolerance: 1%; Packaging: Tape and Reel; Composition: Thick Film; Number of Terminations: 2; Power Rating: 125mW; Voltage Rating: 150V; Termination: SMD/SMT; Military Standard: Not; Length: 2mm; Height: 0.024inch; Width: 1.25mm; Depth: 1.25mm; Lead Free: Lead Free; ComponentLink1URL: https://datasheet.ciiva.com/12558/rc0805-257173-12558854.pdf; ComponentLink1Description: https://datasheet.ciiva.com/12558/rc0805-257173-12558854.pdf; ComponentLink2URL: https://datasheet.ciiva.com/17423/rc0805-17423226.pdf; ComponentLink2Description: https://datasheet.ciiva.com/17423/rc0805-17423226.pdf; ComponentLink3URL: https://datasheet.ciiva.com/2457/pyu-r-int-thick-7-2457389.pdf; ComponentLink3Description: https://datasheet.ciiva.com/2457/pyu-r-int-thick-7-2457389.pdf; ComponentLink4URL: https://datasheet.ciiva.com/2457/pyu-r-int-thick-7-2457390.pdf; ComponentLink4Description: https://datasheet.ciiva.com/2457/pyu-r-int-thick-7-2457390.pdf; ComponentLink5URL: https://datasheet.ciiva.com/2457/pyu-r-int-thick-7-2457391.pdf; ComponentLink5Description: https://datasheet.ciiva.com/2457/pyu-r-int-thick-7-2457391.pdf; Supplier Part Number 1: 311-280CRCT-ND
R4 = RC0805FR-071KL: as R30 on sheet Connectors; Supplier 1: Digi-Key; Manufacturer Part Number: RC0805FR-071KL; Stock 1: 5527973; Pricing 1: 1=0.1, 10=0.022, 100=0.0088, 1000=0.004, 2500=0.0034 (USD); Case/Package: 0805; Number of Pins: 2; Min Operating Temperature: -55°C; Max Operating Temperature: 155°C; Tolerance: 1%; Packaging: Cut Tape; Length: 2mm; Height: 0.5mm; Width: 1.25mm; Depth: 1.25mm; REACH SVHC: No SVHC; Lead Free: Lead Free
R5 = ERJ-M1WTF1M0U: Res Thick Film 2512 0.001 Ohm 1% 1W 250ppm/C to 450ppm/C Molded SMD Embossed Carrier T/R; Manufacturer: Panasonic ECG; Resistance: 1mR; Temperature Coefficient: 450ppm/°C; Supplier 1: Digi-Key; Manufacturer Part Number: ERJ-M1WTF1M0U; Stock 1: 36740; Pricing 1: 1=0.55, 10=0.456, 25=0.3908, 50=0.3516, 100=0.3061, 250=0.2735, 500=0.2214, 1000=0.1791 (USD); Mount: Surface Mount; Case/Package: 2512; Number of Pins: 2; Case Code (Metric): 6432; Case Code (Imperial): 2512; Contact Plating: Tin; Min Operating Temperature: -55°C; Max Operating Temperature: 170°C; Package Quantity: 1; Packaging: Tape and Reel; Power Rating: 1W; Tolerance: 1%; Composition: Thick Film,Metal Strip,Metal Element; Number of Terminations: 2; Termination: SMD/SMT; Military Standard: Not; Max Power Dissipation: 1W; Length: 6.4mm; Height: 0.8mm; Width: 0.126inch; Depth: 3.2mm; Radiation Hardening: No; REACH SVHC: No SVHC; Lead Free: Lead Free; ComponentLink1URL: https://datasheet.ciiva.com/11811/0900766b80befc3b-11811491.pdf; ComponentLink1Description: https://datasheet.ciiva.com/11811/0900766b80befc3b-11811491.pdf; ComponentLink2URL: https://datasheet.ciiva.com/9198/aoa0000ce7-9198885.pdf; ComponentLink2Description: https://datasheet.ciiva.com/9198/aoa0000ce7-9198885.pdf; ComponentLink3URL: https://datasheet.ciiva.com/7777/39800-7777943.pdf; ComponentLink3Description: https://datasheet.ciiva.com/7777/39800-7777943.pdf; ComponentLink4URL: https://datasheet.ciiva.com/16216/aoa0000ce7-16216983.pdf; ComponentLink4Description: https://datasheet.ciiva.com/16216/aoa0000ce7-16216983.pdf; ComponentLink5URL: https://datasheet.ciiva.com/24072/aoa0000ce7-60136-24072248.pdf; ComponentLink5Description: https://datasheet.ciiva.com/24072/aoa0000ce7-60136-24072248.pdf; ComponentLink6URL: https://datasheet.ciiva.com/16512/aoa0000ce7-16512553.pdf; ComponentLink6Description: https://datasheet.ciiva.com/16512/aoa0000ce7-16512553.pdf; ComponentLink7URL: https://datasheet.ciiva.com/16788/70260812-16788394.pdf; ComponentLink7Description: https://datasheet.ciiva.com/16788/70260812-16788394.pdf; ComponentLink8URL: https://datasheet.ciiva.com/5996/39800-5996507.pdf; ComponentLink8Description: https://datasheet.ciiva.com/5996/39800-5996507.pdf; ComponentLink9URL: https://datasheet.ciiva.com/17215/aoa0000ce7-17215229.pdf; ComponentLink9Description: https://datasheet.ciiva.com/17215/aoa0000ce7-17215229.pdf; ComponentLink10URL: https://datasheet.ciiva.com/30206/aoa0000ce7-30206797.pdf; ComponentLink10Description: https://datasheet.ciiva.com/30206/aoa0000ce7-30206797.pdf; ComponentLink11URL: https://datasheet.ciiva.com/16785/70260812-16785566.pdf; ComponentLink11Description: https://datasheet.ciiva.com/16785/70260812-16785566.pdf; Supplier Part Number 1: P1.0NDCT-ND
R40 = RC0805FR-0760R4L: RES SMD 60.4 OHM 1% 1/8W 0805; Manufacturer: Yageo; Resistance: 60.4R; Power Rating: 125mW; Temperature Coefficient: 100ppm/°C; Voltage Rating (DC): 150V; Supplier 1: Digi-Key; Manufacturer Part Number: RC0805FR-0760R4L; Stock 1: 189238; Pricing 1: 1=0.1, 10=0.022, 100=0.0088, 1000=0.004, 2500=0.0034 (USD); Case/Package: 0805; Case Code (Metric): 2012; Case Code (Imperial): 0805; Contact Plating: Tin,Lead,Matte; Min Operating Temperature: -55°C; Max Operating Temperature: 155°C; Package Quantity: 1; Tolerance: 1%; Packaging: Tape and Reel; Composition: Thick Film; Military Standard: Not; Voltage Rating: 150V; Number of Terminations: 2; Termination: SMD/SMT; Max Power Dissipation: 125mW; Length: 0.079inch; Height: 0.024inch; Width: 0.049inch; Depth: 1.25mm; Radiation Hardening: No; Lead Free: Lead Free; ComponentLink1URL: https://datasheet.ciiva.com/2457/pyu-r-int-thick-7-2457216.pdf; ComponentLink1Description: https://datasheet.ciiva.com/2457/pyu-r-int-thick-7-2457216.pdf; ComponentLink2URL: https://datasheet.ciiva.com/2457/pyu-r-int-thick-7-2457217.pdf; ComponentLink2Description: https://datasheet.ciiva.com/2457/pyu-r-int-thick-7-2457217.pdf; ComponentLink3URL: https://datasheet.ciiva.com/2457/pyu-r-int-thick-7-2457215.pdf; ComponentLink3Description: https://datasheet.ciiva.com/2457/pyu-r-int-thick-7-2457215.pdf; Supplier Part Number 1: 311-60.4CRDKR-ND
TP1-TP4 TP14 TP15 = 5015: TEST POINT, PCB, SMT; Manufacturer: Keystone Electronics; Number of Ports: 1; Supplier 1: Digi-Key; Manufacturer Part Number: 5015; Stock 1: 1937775; Pricing 1: 1=0.44, 10=0.421, 25=0.3604, 50=0.3064, 100=0.2944, 250=0.2644, 500=0.2524 (USD); Mount: Surface Mount; Colour: White; Contact Material: Bronze; Contact Plating: Tin,Silver,Lead; Material: Bronze,Silver; Package Quantity: 1; Packaging: Tape and Reel; Termination: Solder; Orientation: Straight; Length: 2.66mm; Height: 0.06inch; Thickness: 0.01inch; Depth: 1.01mm; REACH SVHC: No SVHC; Lead Free: Lead Free; ComponentLink1URL: https://datasheet.ciiva.com/2917/5015-2917616.pdf; ComponentLink1Description: https://datasheet.ciiva.com/2917/5015-2917616.pdf; ComponentLink2URL: https://datasheet.ciiva.com/2917/5015-2917617.pdf; ComponentLink2Description: https://datasheet.ciiva.com/2917/5015-2917617.pdf; ComponentLink3URL: https://datasheet.ciiva.com/1123/5015-1123862.pdf; ComponentLink3Description: https://datasheet.ciiva.com/1123/5015-1123862.pdf; ComponentLink4URL: https://datasheet.ciiva.com/16883/70182998-16883734.pdf; ComponentLink4Description: https://datasheet.ciiva.com/16883/70182998-16883734.pdf; Supplier Part Number 1: 36-5015CT-ND
U1 = INA226AIDGSR: IC MONITOR PWR/CURR BIDIR 10MSOP; Manufacturer: Texas Instruments; Min Supply Voltage: 2.7V; Max Supply Voltage: 5.5V; Nominal Supply Current: 330uA; Common Mode Rejection Ratio: 140dB; Output Current: 10mA; Input Bias Current: 10uA; Input Offset Voltage (Vos): 2.5uV; Accuracy: 0.02%; Supplier 1: Digi-Key; Manufacturer Part Number: INA226AIDGSR; Stock 1: 62674; Pricing 1: 1=2.95, 10=2.648, 100=2.1692, 500=1.8466, 1000=1.5574 (USD); Mount: Surface Mount; Case/Package: VSSOP; Number of Pins: 10; Contact Plating: Gold; Min Operating Temperature: -40°C; Max Operating Temperature: 125°C; Packaging: Tape and Reel; Package Quantity: 1; Radiation Hardening: No; REACH SVHC: No SVHC; Lead Free: Lead Free; ComponentLink1URL: https://datasheet.ciiva.com/1939/ina226-1939633.pdf; ComponentLink1Description: https://datasheet.ciiva.com/1939/ina226-1939633.pdf; ComponentLink2URL: https://datasheet.ciiva.com/1939/ina226-1939634.pdf; ComponentLink2Description: https://datasheet.ciiva.com/1939/ina226-1939634.pdf; ComponentLink3URL: https://datasheet.ciiva.com/1939/ina226-1939635.pdf; ComponentLink3Description: https://datasheet.ciiva.com/1939/ina226-1939635.pdf; ComponentLink4URL: https://datasheet.ciiva.com/14196/ina226-14196741.pdf; ComponentLink4Description: https://datasheet.ciiva.com/14196/ina226-14196741.pdf; ComponentLink5URL: https://datasheet.ciiva.com/4875/sbos547-126280-4875559.pdf; ComponentLink5Description: https://datasheet.ciiva.com/4875/sbos547-126280-4875559.pdf; ComponentLink6URL: https://datasheet.ciiva.com/22693/1840205-22693516.pdf; ComponentLink6Description: https://datasheet.ciiva.com/22693/1840205-22693516.pdf; Supplier Part Number 1: 296-29034-1-ND
U2 = 78SRH-5/2-C: DCDC 5V MURATA POWER SOLUTIONS 	   	78SRH-5/2-C 	   	IC, SYNC SWITCHING REGULATOR, TO-220-3; Output Current: 2A; Number of Outputs: 1; Max Input Voltage: 32V; Min Input Voltage: 8V; Nominal Input Voltage: 12V; Output Power: 10W; Efficiency: 95%; Isolation: Isolated; Supplier 1: Digi-Key; Manufacturer: Murata; Manufacturer Part Number: 78SRH-5/2-C; Stock 1: 2978; Pricing 1: 1=13.95, 5=12.2, 10=10.959 (USD); Mount: Through Hole; Case/Package: SIP; Number of Pins: 3; Weight: 1lb; Min Operating Temperature: -40°C; Max Operating Temperature: 70°C; Packaging: Box; Output Voltage: 5V; Max Output Current: 2A; Nominal Output Voltage: 5V; Min Input Voltage (DC): 8V; Package Quantity: 144; Max Input Voltage (DC): 32V; Voltage - Output 1: 5V; Current - Output 1: 2A; Max Output Power: 10W; Max Power Dissipation: 10W; Length: 20.3mm; Height: 0.28inch; Width: 0.8inch; Depth: 7.1mm; Radiation Hardening: No; REACH SVHC: No SVHC; Lead Free: Lead Free; ComponentLink1URL: https://datasheet.ciiva.com/3240/mpm-78sr-2a-a00-3240576.pdf; ComponentLink1Description: https://datasheet.ciiva.com/3240/mpm-78sr-2a-a00-3240576.pdf; ComponentLink2URL: https://datasheet.ciiva.com/1170/698935-1170225.pdf; ComponentLink2Description: https://datasheet.ciiva.com/1170/698935-1170225.pdf; ComponentLink3URL: https://datasheet.ciiva.com/26809/getdatasheetpartid-357559-26809336.pdf; ComponentLink3Description: https://datasheet.ciiva.com/26809/getdatasheetpartid-357559-26809336.pdf; ComponentLink4URL: https://datasheet.ciiva.com/16627/mpm-78sr-2a-a00-16627849.pdf; ComponentLink4Description: https://datasheet.ciiva.com/16627/mpm-78sr-2a-a00-16627849.pdf; ComponentLink5URL: https://datasheet.ciiva.com/16405/mpm-78sr-2a-a00-16405759.pdf; ComponentLink5Description: https://datasheet.ciiva.com/16405/mpm-78sr-2a-a00-16405759.pdf; Supplier Part Number 1: 811-2657-ND
U3 = NKE0503SC: DCDC 3V3 CONVERTER 3.3V 1W; Manufacturer: Murata; Output Current: 303mA; Number of Outputs: 1; Min Input Voltage (DC): 4.5V; Max Input Voltage (DC): 5.5V; Efficiency: 74%; Nominal Input Voltage: 5V; Isolation Voltage: 3kV; Isolation: Isolated; Supplier 1: Digi-Key; Manufacturer Part Number: NKE0503SC; Stock 1: 748; Pricing 1: 1=7.61, 5=7.57, 10=7.52, 25=7.43, 50=7.25, 100=6.89, 250=6.45, 500=6.01, 1000=5.985 (USD); Mount: Through Hole; Case/Package: SIP; Number of Pins: 4; Min Operating Temperature: -40°C; Max Operating Temperature: 85°C; Packaging: Rail/Tube; Package Quantity: 40; Output Voltage: 3.3V; Output Power: 1W; Max Output Current: 303mA; Nominal Output Voltage: 3.3V; Max Input Voltage: 5.5V; Min Input Voltage: 4.5V; Voltage - Output 1: 3.3V; Current - Output 1: 303mA; Max Output Power: 1W; Max Power Dissipation: 1W; Length: 11.48mm; Height: 7.46mm; Width: 6mm; Depth: 6mm; Radiation Hardening: No; REACH SVHC: No SVHC; Flammability Rating: UL94 V-0; ComponentLink1URL: https://datasheet.ciiva.com/18018/getdatasheetpartid-363088-18018901.pdf; ComponentLink1Description: https://datasheet.ciiva.com/18018/getdatasheetpartid-363088-18018901.pdf; ComponentLink2URL: https://datasheet.ciiva.com/16627/kdc-nke-16627961.pdf; ComponentLink2Description: https://datasheet.ciiva.com/16627/kdc-nke-16627961.pdf; ComponentLink3URL: https://datasheet.ciiva.com/2169/kdc-nke-2169402.pdf; ComponentLink3Description: https://datasheet.ciiva.com/2169/kdc-nke-2169402.pdf; ComponentLink4URL: https://datasheet.ciiva.com/8011/1790387-8011754.pdf; ComponentLink4Description: https://datasheet.ciiva.com/8011/1790387-8011754.pdf; ComponentLink5URL: https://datasheet.ciiva.com/29186/158161-da-01-en-dc-dc-wandler-nke0503sc-mps-29186131.pdf; ComponentLink5Description: https://datasheet.ciiva.com/29186/158161-da-01-en-dc-dc-wandler-nke0503sc-mps-29186131.pdf; Supplier Part Number 1: 811-1432-5-ND